# EAGLE design zerod (EAGLE 7.1.0)
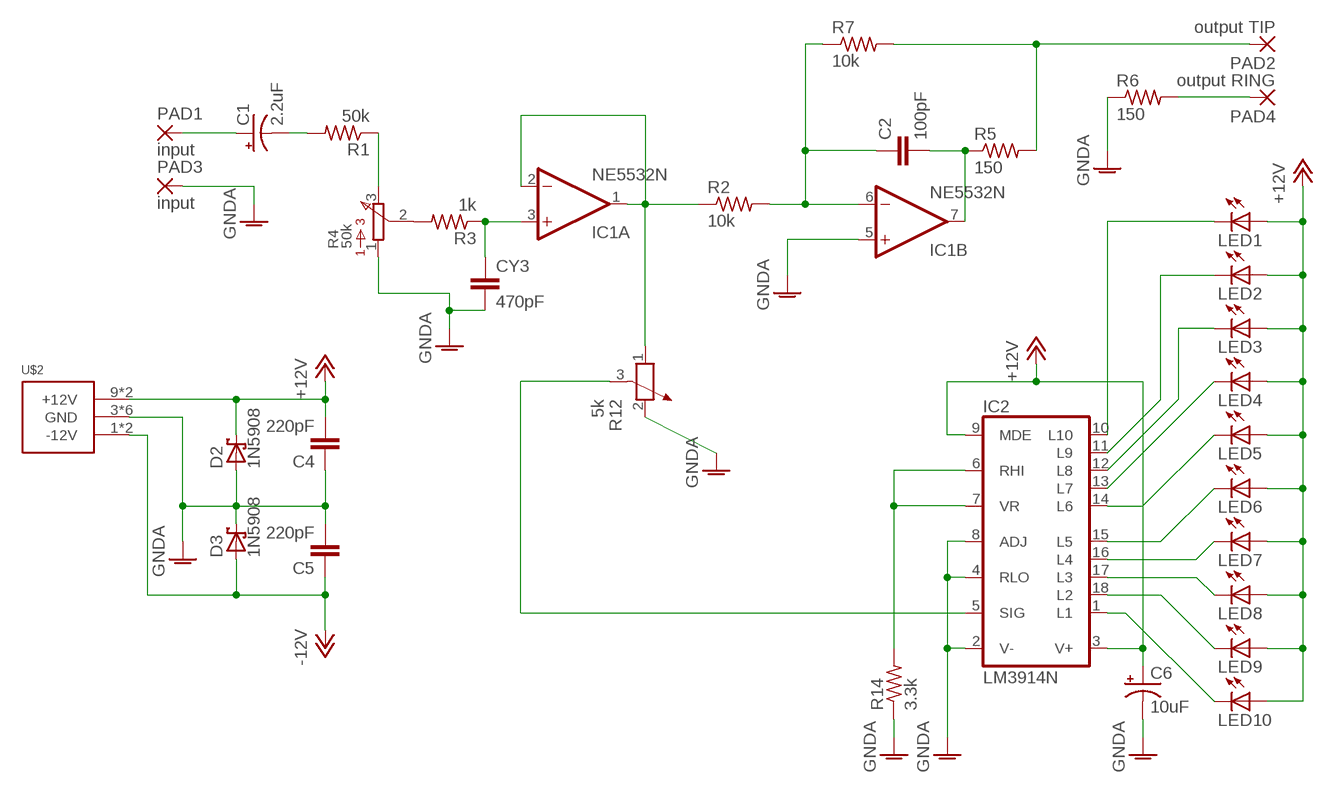
[diagram p0: schematic, sheet 1]

## Parts
C1  2.2uF  CPOL-USE15-6AXIAL  [E15-6]
C2  100pF  C2.5/6  [C2.5-6]
C4  220pF  C-EU025-024X044  [C025-024X044]
C5  220pF  C-EU025-024X044  [C025-024X044]
C6  10uF  CPOL-USE1.8-4  [E1,8-4]
CY3  470pF  CYYC7B5  [YC7B5]
D2  1N5908  [C4111-15]
D3  1N5908  [C4111-15]
IC1  NE5532N  [DIL08]
IC2  LM3914N  [DIL18]
LED1  LED5MM  [LED5MM]
LED2  LED5MM  [LED5MM]
LED3  LED5MM  [LED5MM]
LED4  LED5MM  [LED5MM]
LED5  LED5MM  [LED5MM]
LED6  LED5MM  [LED5MM]
LED7  LED5MM  [LED5MM]
LED8  LED5MM  [LED5MM]
LED9  LED5MM  [LED5MM]
LED10  LED5MM  [LED5MM]
PAD1  input  3,17/1,3  [3,17/1,3]
PAD2  output TIP  3,17/1,3  [3,17/1,3]
PAD3  input  3,17/1,3  [3,17/1,3]
PAD4  output RING  3,17/1,3  [3,17/1,3]
R1  50k  R-US_0207/10  [0207/10]
R2  10k  R-US_0207/10  [0207/10]
R3  1k  R-US_0207/10  [0207/10]
R4  50k  91  [91]
R5  150  R-US_0207/10  [0207/10]
R6  150  R-US_0207/10  [0207/10]
R7  10k  R-US_0207/10  [0207/10]
R12  5k  POTENTIOMETER_PT-10S  [PT-10S]
R14  3.3k  R-US_0207/10  [0207/10]
U$2  POWER_SIMPLE10  [POWER_10]

## Nets
+12V: C4.2 C6.+ D2.C IC2.3(V+) IC2.9(MDE) LED1.A LED2.A LED3.A LED4.A LED5.A LED6.A LED7.A LED8.A LED9.A LED10.A U$2.9(+12V) U$2.10(+12V)
-12V: C5.1 D3.A U$2.1(-12V) U$2.2(-12V)
GNDA: C4.1 C5.2 C6.- CY3.2 D2.A D3.C IC1.5(B:+IN) IC2.2(V-) IC2.4(RLO) IC2.8(ADJ) PAD3.1(P) R4.1 R6.1 R12.2 R14.1 U$2.3(GND) U$2.4(GND) U$2.5(GND) U$2.6(GND) U$2.7(GND) U$2.8(GND)
N$1: C1.+ PAD1.1(P)
N$2: C1.- R1.2
N$4: R1.1 R4.3
N$5: PAD4.1(P) R6.2
N$6: CY3.1 IC1.3(A:+IN) R3.1
N$7: R3.2 R4.2
N$8: C2.1 IC1.6(B:-IN) R2.2 R7.1
N$9: C2.2 IC1.7(B:OUT) R5.1
N$10: IC1.1(A:OUT) IC1.2(A:-IN) R2.1 R12.1
N$11: IC2.10(L10) LED1.K(C)
N$12: IC2.5(SIG) R12.3
N$13: IC2.11(L9) LED2.K(C)
N$14: IC2.6(RHI) IC2.7(VR) R14.2
N$15: PAD2.1(P) R5.2 R7.2
N$16: IC2.12(L8) LED3.K(C)
N$17: IC2.13(L7) LED4.K(C)
N$18: IC2.14(L6) LED5.K(C)
N$19: IC2.15(L5) LED6.K(C)
N$20: IC2.16(L4) LED7.K(C)
N$21: IC2.17(L3) LED8.K(C)
N$22: IC2.18(L2) LED9.K(C)
N$23: IC2.1(L1) LED10.K(C)

## Power pins joined to a net without a drawn wire
+12V: IC1.8(P:V+)
-12V: IC1.4(P:V-)

## Library data of the parts
C1 C6 = rcl:CPOL-US: POLARIZED CAPACITOR, American symbol
C2 = capacitor-wima:C: CAPACITOR naming: grid - package width
C4 C5 = rcl:C-EU: CAPACITOR, European symbol
CY3 = rcl:CY: Y CAPACITOR for power line
D2 D3 = diode:1N5908: DIODE schottky
IC1 = linear:NE5532: AUDIO AMPLIFIER
IC2 = linear:LM3914N: LED DRIVER senses analog voltage levels and drives 10 LEDs
LED1-LED10 = led:LED: LED OSRAM: - CHIPLED LG R971, LG N971, LY N971, LG Q971, LY Q971, LO R971, LY R971 LH N974, LH R974 LS Q976, LO Q976, LY Q976 LO Q996 - Hyper CHIPLED LW Q18S LB Q993, LB Q99A, LB R99A - SideLED LS A670, LO A670, LY A670, LG A670, LP A670 LB A673, LV A673, LT A673, LW A673 LH A674 LY A675 LS A676, LA A676, LO A676, LY A676, LW A676 LS A679, LY A679, LG A679 - Hyper Micro SIDELED® LS Y876, LA Y876, LO Y876, LY Y876 LT Y87S - SmartLED LW L88C, LW L88S LB L89C, LB L89S, LG L890 LS L89K, LO L89K, LY L89K LS L896, LA L896, LO L896, LY L896 - TOPLED LS T670, LO T670, LY T670, LG T670, LP T670 LSG T670, LSP T670, LSY T670, LOP T670, LYG T670 LG T671, LOG T671, LSG T671 LB T673, LV T673, LT T673, LW T673 LH T674 LS T676, LA T676, LO T676, LY T676, LB T676, LH T676, LSB T676, LW T676 LB T67C, LV T67C, LT T67C, LS T67K, LO T67K, LY T67K, LW E67C LS E67B, LA E67B, LO E67B, LY E67B, LB E67C, LV E67C, LT E67C LW T67C LS T679, LY T679, LG T679 LS T770, LO T770, LY T770, LG T770, LP T770 LB T773, LV T773, LT T773, LW T773 LH T774 LS E675, LA E675, LY E675, LS T675 LS T776, LA T776, LO T776, LY T776, LB T776 LHGB T686 LT T68C, LB T68C - Hyper Mini TOPLED® LB M676 - Mini TOPLED Santana® LG M470 LS M47K, LO M47K, LY M47K Source: http://www.osram.convergy.de LUXEON: - LUMILED® LXK2-PW12-R00, LXK2-PW12-S00, LXK2-PW14-U00, LXK2-PW14-V00 LXK2-PM12-R00, LXK2-PM12-S00, LXK2-PM14-U00 LXK2-PE12-Q00, LXK2-PE12-R00, LXK2-PE12-S00, LXK2-PE14-T00, LXK2-PE14-U00 LXK2-PB12-K00, LXK2-PB12-L00, LXK2-PB12-M00, LXK2-PB14-N00, LXK2-PB14-P00, LXK2-PB14-Q00 LXK2-PR12-L00, LXK2-PR12-M00, LXK2-PR14-Q00, LXK2-PR14-R00 LXK2-PD12-Q00, LXK2-PD12-R00, LXK2-PD12-S00 LXK2-PH12-R00, LXK2-PH12-S00 LXK2-PL12-P00, LXK2-PL12-Q00, LXK2-PL12-R00 Source: www.luxeon.com KINGBRIGHT: KA-3528ASYC Source: www.kingbright.com
PAD1-PAD4 = wirepad:3,17/1,3: THROUGH-HOLE PAD
R1-R3 R5-R7 R14 = rcl:R-US_: RESISTOR, American symbol
R4 = bourns:91: 91 Series Potentiometer
R12 = rcl:POTENTIOMETER_: Potentiometer
U$2 = eurorack:POWER_SIMPLE

## Net classes
0 default: clearance 0.205 mm

## Board
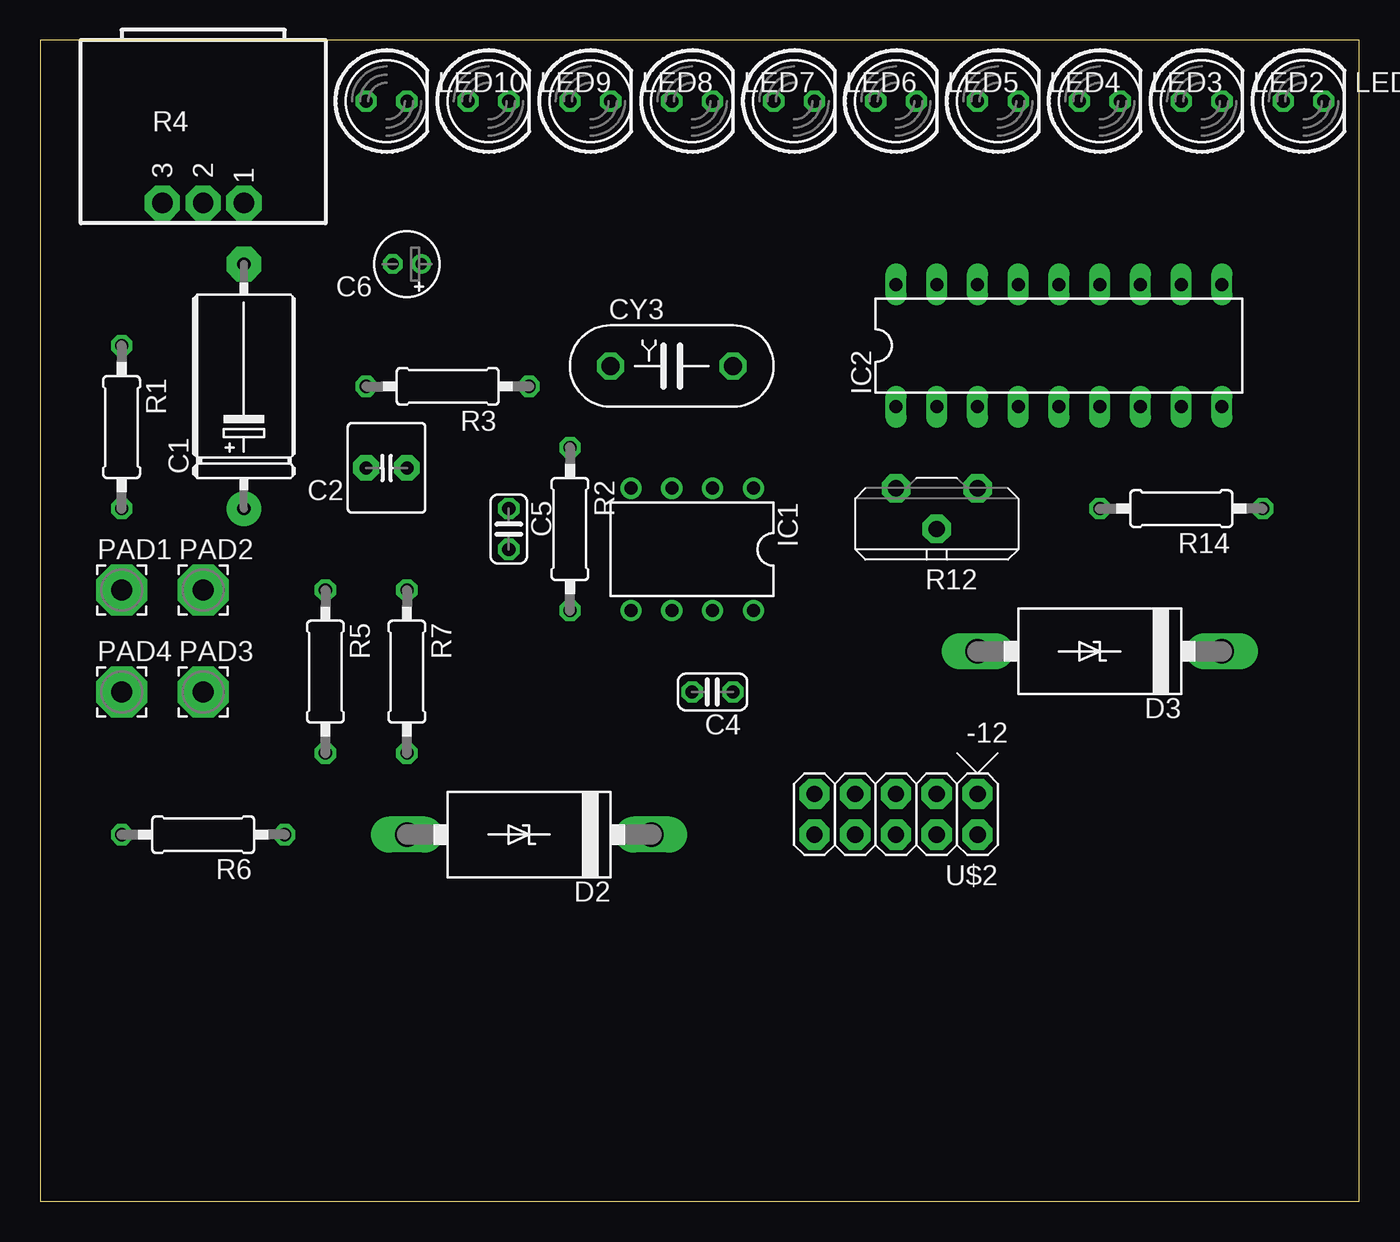
[diagram p1: board, top side]
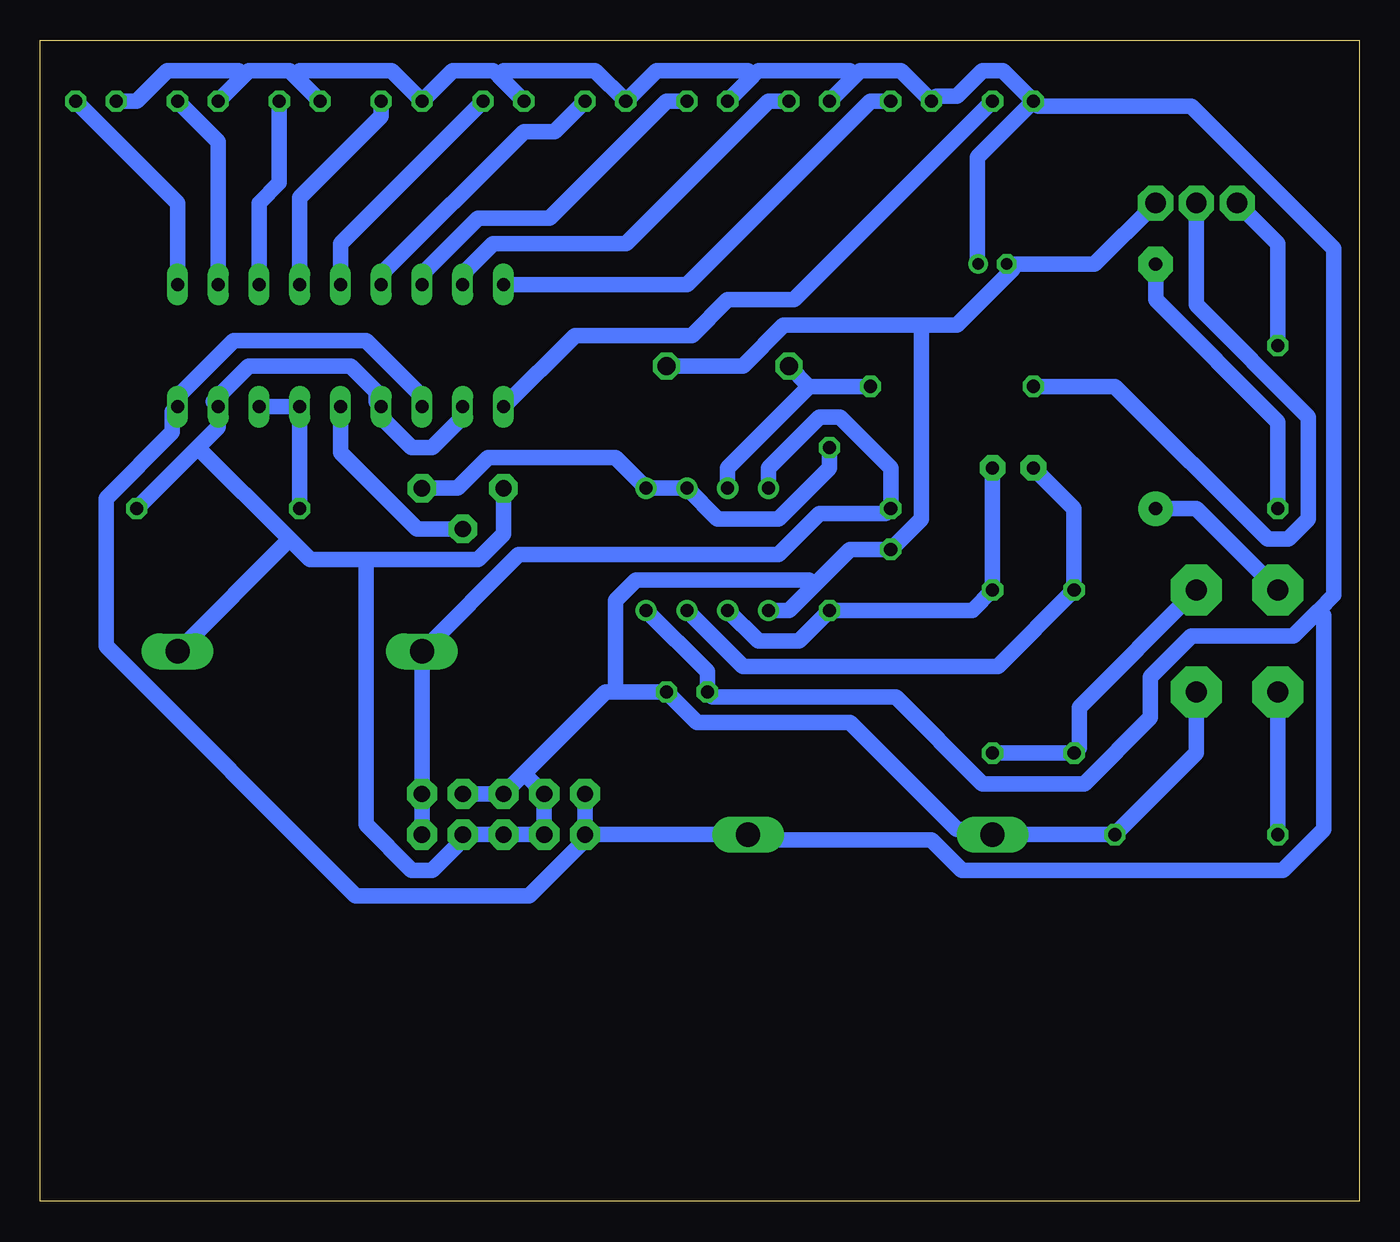
[diagram p2: board, bottom side, seen from below]

Size 82.22 x 72.38 mm. Coordinates in mm from the lower left corner, seen from the top.
Outline: 0,0 82.22,0 82.22,72.38 0,72.38 0,0
Copper layers (1*16): Top 0.035mm / dielectric 1.5mm / Bottom 0.035mm
Design rules "working_cnc_etch_rules *": minimum track width 38mil, minimum drill 24mil, track to track 18mil, track to pad 20mil, pad to pad 20mil, via to via 8mil, smd to smd 8mil, copper to edge 40mil, drill to drill 8mil, minimum pad ring 10mil, minimum via ring 8mil, stop-mask expansion 4mil, vias tented up to drill 0mil, thermal gap 10mil

### Footprints (pad centres in the part's own frame; a part is rotated, then mirrored left to right if it is on the bottom)
E15-6 = drill 0.813 pad 2.159: + -7.62,0 | drill 0.813 pad 2.159 octagon: - 7.62,0
C2.5-6 = drill 0.813 pad 1.6 octagon: 1 -1.27,0; 2 1.27,0
C025-024X044 = drill 0.813 octagon: 1 -1.27,0; 2 1.27,0
E1,8-4 = drill 0.711 pad 1.168: + -0.889,0 | drill 0.711 pad 1.168 octagon: - 0.889,0
YC7B5 = drill 1.118 octagon: 1 -3.81,0; 2 3.81,0
C4111-15 = drill 1.499 long: A 7.62,0; C -7.62,0
DIL08 = drill 0.813 pad 1.27: 1 -3.81,-3.81; 2 -1.27,-3.81; 3 1.27,-3.81; 4 3.81,-3.81; 5 3.81,3.81; 6 1.27,3.81; 7 -1.27,3.81; 8 -3.81,3.81
DIL18 = drill 0.813 long: 1 -10.16,-3.81; 2 -7.62,-3.81; 3 -5.08,-3.81; 4 -2.54,-3.81; 5 0,-3.81; 6 2.54,-3.81; 7 5.08,-3.81; 8 7.62,-3.81; 9 10.16,-3.81; 10 10.16,3.81; 11 7.62,3.81; 12 5.08,3.81; 13 2.54,3.81; 14 0,3.81; 15 -2.54,3.81; 16 -5.08,3.81; 17 -7.62,3.81; 18 -10.16,3.81
LED5MM = drill 0.813 octagon: A -1.27,0; K 1.27,0
3,17/1,3 = drill 1.321 pad 3.175 octagon: 1 0,0
0207/10 = drill 0.813 octagon: 1 -5.08,0; 2 5.08,0
91 = drill 1.27 pad 2.184 octagon: 1 0,2.54; 2 0,0; 3 0,-2.54
PT-10S = drill 1.016 pad 1.778 octagon: 1 -2.54,-1.27; 2 2.54,-1.27; 3 0,1.27
POWER_10 = drill 1.016 pad 1.88 octagon: 1 -5.08,-1.27; 2 -5.08,1.27; 3 -2.54,-1.27; 4 -2.54,1.27; 5 0,-1.27; 6 0,1.27; 7 2.54,-1.27; 8 2.54,1.27; 9 5.08,-1.27; 10 5.08,1.27

### Placement (x,y rotation side)
C1  12.7,50.8 90 top
C2  21.59,45.72 180 top
C4  41.91,31.75 180 top
C5  29.21,41.91 270 top
C6  22.86,58.42 180 top
CY3  39.37,52.07 0 top
D2  30.48,22.86 180 top
D3  66.04,34.29 180 top
IC1  40.64,40.64 180 top
IC2  63.5,53.34 0 top
LED1  78.74,68.58 0 top
LED2  72.39,68.58 0 top
LED3  66.04,68.58 0 top
LED4  59.69,68.58 0 top
LED5  53.34,68.58 0 top
LED6  46.99,68.58 0 top
LED7  40.64,68.58 0 top
LED8  34.29,68.58 0 top
LED9  27.94,68.58 0 top
LED10  21.59,68.58 0 top
PAD1  5.08,38.1 0 top
PAD2  10.16,38.1 0 top
PAD3  10.16,31.75 0 top
PAD4  5.08,31.75 0 top
R1  5.08,48.26 270 top
R2  33.02,41.91 270 top
R3  25.4,50.8 180 top
R4  10.16,62.23 270 top
R5  17.78,33.02 270 top
R6  10.16,22.86 180 top
R7  22.86,33.02 270 top
R12  55.88,43.18 180 top
R14  71.12,43.18 180 top
U$2  53.34,24.13 180 top

### Tracks (layer width: path | path; a pad name or v marks a point on that pad's centre or on a via)
+12V
  Bottom 0.965: LED8.A 31.43,70.17 | 31.43,70.17 31.11,70.48 28.57,70.48 LED9.A 26.35,68.9 25.08,68.9 23.5,70.48 22.23,70.48 LED10.A | 37.78,70.17 37.47,70.48 31.75,70.48 31.43,70.17 | 37.78,70.17 LED7.A | 37.78,70.17 38.1,70.48 43.81,70.48 LED6.A 47.62,70.48 53.34,70.48 53.66,70.17 | 53.66,70.17 53.98,70.48 56.52,70.48 LED4.A 60.33,70.48 66.04,70.48 66.36,70.17 | 53.66,70.17 LED5.A | 66.36,70.17 66.67,70.48 69.22,70.48 69.53,70.17 | 66.36,70.17 LED3.A | LED2.A 69.53,70.17 | LED1.A 76.2,68.58 74.3,70.48 69.85,70.48 69.53,70.17 | IC2.3 58.42,50.16 61.91,53.66 70.17,53.66 73.66,50.16 IC2.9 73.98,49.21 73.98,47.94 78.11,43.82 78.11,34.61 62.55,19.05 51.75,19.05 48.26,22.54 U$2.10 | U$2.9 U$2.10 | U$2.10 D2.C 37.78,22.54 26.67,22.54 24.77,20.64 4.76,20.64 2.22,23.18 2.22,36.51 2.54,36.83 | IC1.8 40.64,33.02 C4.2 40.32,31.43 28.89,31.43 23.5,26.04 17.14,26.04 13.02,30.16 13.02,32.7 10.48,35.24 4.13,35.24 2.54,36.83 | LED10.A 23.81,65.09 23.81,58.42 C6.+ | 2.54,36.83 1.59,37.78 1.59,59.37 10.48,68.26 20,68.26 LED10.A
-12V
  Bottom 0.965: IC1.4 36.83,45.72 33.66,48.9 32.38,48.9 29.21,45.72 C5.1 29.53,42.86 33.66,42.86 36.2,40.32 52.39,40.32 D3.A U$2.1 U$2.2
GNDA
  Bottom 0.965: IC2.2 55.88,48.9 57.78,46.99 59.05,46.99 60.96,48.9 IC2.4 61.28,49.85 61.28,50.48 62.87,52.07 69.22,52.07 71.44,49.85 IC2.8 71.12,48.26 72.39,46.99 | R14.1 72.39,46.99 | R12.2 53.34,41.59 54.93,40.01 61.91,40.01 | 61.91,40.01 65.41,40.01 66.67,41.28 | 72.39,46.99 66.67,41.28 | 66.67,41.28 D3.C | PAD3.1 10.16,27.94 R6.1 D2.A 23.18,23.18 25.08,23.18 31.75,29.85 41.27,29.85 C4.1 46.35,31.75 | 46.35,31.75 46.99,31.75 52.07,26.67 | 52.07,26.67 U$2.5 U$2.3 | 52.07,26.67 U$2.7 U$2.8 U$2.6 U$2.4 55.88,22.54 57.78,20.64 59.05,20.64 61.91,23.49 61.91,40.01 | IC1.5 35.56,36.83 33.97,38.42 | 33.97,38.42 31.75,40.64 C5.2 27.3,42.55 27.3,54.61 | R4.1 16.51,58.42 C6.- 21.59,58.1 25.08,54.61 27.3,54.61 | CY3.2 38.42,52.07 35.88,54.61 27.3,54.61 | 46.35,31.75 46.35,37.47 45.09,38.73 34.29,38.73 33.97,38.42
N$1
  Bottom 0.965: C1.+ 10.16,43.18 PAD1.1
N$2
  Bottom 0.965: R1.2 5.08,48.58 12.7,56.2 C1.-
N$4
  Bottom 0.965: R1.1 5.08,59.69 R4.3
N$5
  Bottom 0.965: PAD4.1 R6.2
N$6
  Bottom 0.965: 34.29,50.8 R3.1 | CY3.1 34.29,50.8 | IC1.3 39.37,45.72 34.29,50.8
N$7
  Bottom 0.965: R3.2 15.24,50.8 5.71,41.28 4.45,41.28 3.17,42.55 3.17,48.9 10.16,55.88 R4.2
N$8
  Bottom 0.965: IC1.6 37.47,34.93 34.92,34.93 R2.2 24.13,36.83 R7.1 C2.1
N$9
  Bottom 0.965: C2.2 17.78,43.18 R5.1 22.54,33.34 38.42,33.34 IC1.7
N$10
  Bottom 0.965: R2.1 33.02,45.72 36.2,42.55 40.01,42.55 IC1.2 IC1.1 46.35,46.36 54.29,46.36 56.2,44.45 R12.1
N$11
  Bottom 0.965: IC2.10 73.66,62.23 LED1.K
N$12
  Bottom 0.965: IC2.5 63.5,46.67 58.74,41.91 R12.3
N$13
  Bottom 0.965: IC2.11 71.12,66.04 LED2.K
N$14
  Bottom 0.965: R14.2 IC2.6 IC2.7
N$15
  Bottom 0.965: R7.2 R5.2 17.46,28.26 17.46,30.8 PAD2.1
N$16
  Bottom 0.965: LED3.K 67.31,63.5 68.58,62.23 IC2.12
N$17
  Bottom 0.965: IC2.13 66.04,62.55 60.96,67.63 LED4.K
N$18
  Bottom 0.965: IC2.14 63.5,59.69 LED5.K
N$19
  Bottom 0.965: IC2.15 60.96,57.79 52.07,66.67 50.16,66.67 LED6.K
N$20
  Bottom 0.965: LED7.K 43.18,68.58 50.48,61.28 54.93,61.28 58.42,57.79 IC2.16
N$21
  Bottom 0.965: LED8.K 36.83,68.58 45.72,59.69 53.98,59.69 55.88,57.79 IC2.17
N$22
  Bottom 0.965: LED9.K 30.48,68.58 41.91,57.15 IC2.18
N$23
  Bottom 0.965: LED10.K 35.24,56.2 39.37,56.2 41.59,53.98 48.9,53.98 IC2.1